# EAGLE design mainboard (EAGLE 7.7.0)
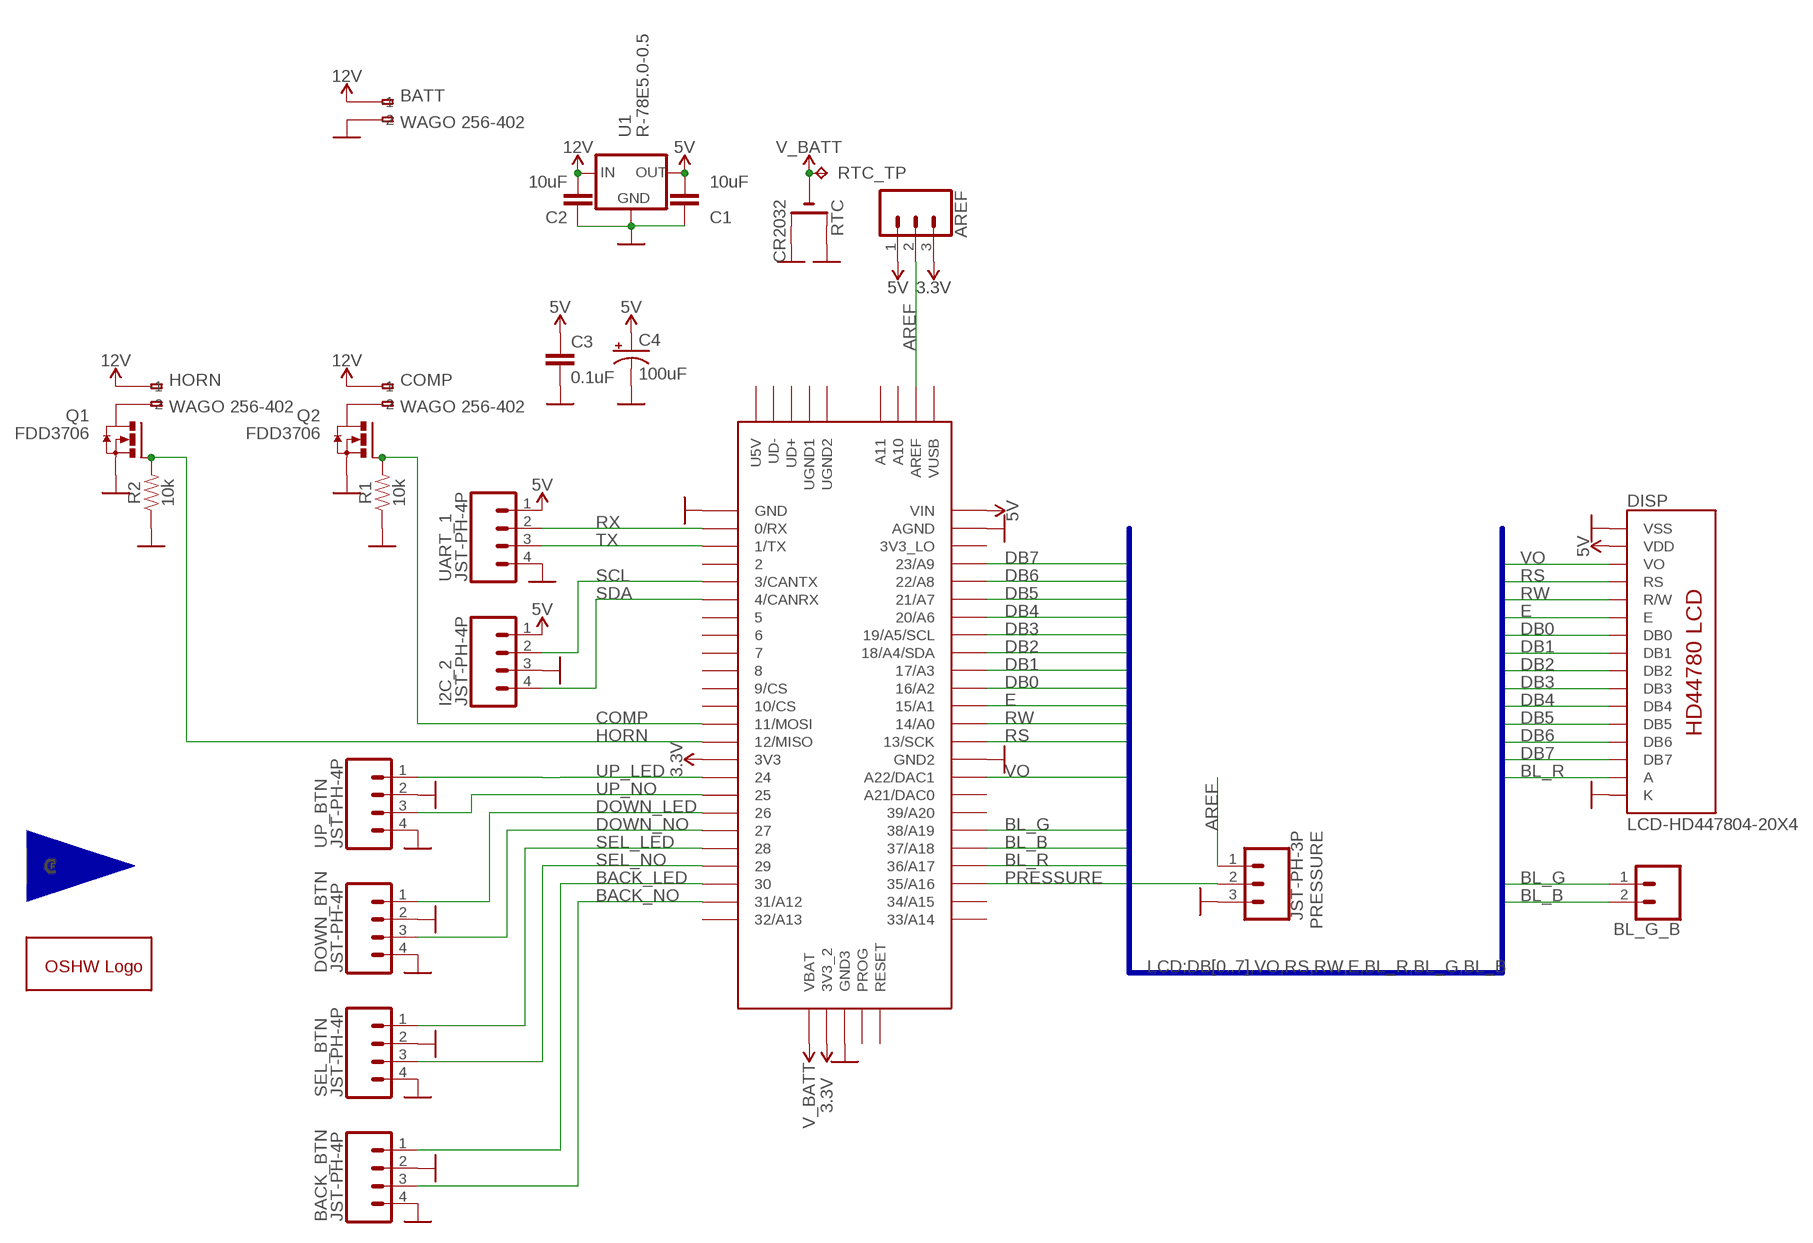
[diagram p0: schematic, sheet 1]

## Parts
AREF  CONN_03LOCK  [1X03_LOCK]
BACK_BTN  JST-PH-4P  CONN_04JST-PTH-VERT  [JST-4-PTH-VERT]
BATT  WAGO 256-402  255-402-5  [255-402-5]
BL_G_B  CONN_02  [1X02]
C1  10uF  10UF-0603-6.3V-20%  [0603]
C2  10uF  10UF-0603-6.3V-20%  [0603]
C3  0.1uF  0.1UF-0603-25V-(+80/-20%)  [0603]
C4  100uF  100UF-POLAR-10X10.5-63V-20%  [NIC_10X10.5_CAP]
COMP  WAGO 256-402  255-402-5  [255-402-5]
DISP  LCD-HD447804-20X4  LCD-HD447804-HOLES20X4-4HOLES  [LCD-20X4-4HOLES]
DOWN_BTN  JST-PH-4P  CONN_04JST-PTH-VERT  [JST-4-PTH-VERT]
GOLD_ORB_SM1  OSHWLOGOLOGO8MM  [OSHW_8MM]
HORN  WAGO 256-402  255-402-5  [255-402-5]
I2C_2  JST-PH-4P  CONN_04JST-PTH-VERT  [JST-4-PTH-VERT]
PRESSURE  JST-PH-3P  CONN_03JST-PTH-VERT  [JST-3-PTH-VERT]
Q1  FDD3706  IRF3704S  [D2PACK]
Q2  FDD3706  IRF3704S  [D2PACK]
R1  10k  10KOHM-0603-1/10W-1%  [0603]
R2  10k  10KOHM-0603-1/10W-1%  [0603]
RTC  CR2032  CR2032SMT  [CR2032-SMD]
RTC_TP  TPPAD1-17  [P1-17]
SEL_BTN  JST-PH-4P  CONN_04JST-PTH-VERT  [JST-4-PTH-VERT]
TEENSY  TEENSY_3.5/3.6  [TEENSY_3.5/3.6]
U1  R-78E5.0-0.5  R-78E5.0-1.0  [DC-DC_CONVERTER_78XX]
U$1  CFLOGO  [CFLOGO]
UART_1  JST-PH-4P  CONN_04JST-PTH-VERT  [JST-4-PTH-VERT]
UP_BTN  JST-PH-4P  CONN_04JST-PTH-VERT  [JST-4-PTH-VERT]

## Nets
3.3V: AREF.3 TEENSY.3V3 TEENSY.3V3_2
5V: AREF.1 C1.2 C3.1 C4.+ DISP.P$2(VDD) I2C_2.1 TEENSY.VIN U1.VOUT(OUT) UART_1.1
12V: BATT.A1(-1) C2.2 COMP.A1(-1) HORN.A1(-1) U1.VIN(IN)
AREF: AREF.2 PRESSURE.1 TEENSY.AREF
BACK_LED: BACK_BTN.1 TEENSY.30
BACK_NO: BACK_BTN.3 TEENSY.31/A12
BL_B: BL_G_B.2 TEENSY.37/A18
BL_G: BL_G_B.1 TEENSY.38/A19
BL_R: DISP.P$15(A) TEENSY.36/A17
COMP: Q2.1(G) R1.2 TEENSY.11/MOSI
DB0: DISP.P$7(DB0) TEENSY.16/A2
DB1: DISP.P$8(DB1) TEENSY.17/A3
DB2: DISP.P$9(DB2) TEENSY.18/A4/SDA
DB3: DISP.P$10(DB3) TEENSY.19/A5/SCL
DB4: DISP.P$11(DB4) TEENSY.20/A6
DB5: DISP.P$12(DB5) TEENSY.21/A7
DB6: DISP.P$13(DB6) TEENSY.22/A8
DB7: DISP.P$14(DB7) TEENSY.23/A9
DOWN_LED: DOWN_BTN.1 TEENSY.26
DOWN_NO: DOWN_BTN.3 TEENSY.27
E: DISP.P$6(E) TEENSY.15/A1
GND: BACK_BTN.2 BACK_BTN.4 BATT.A2(-2) C1.1 C2.1 C3.2 C4.- DISP.P$1(VSS) DISP.P$16(K) DOWN_BTN.2 DOWN_BTN.4 I2C_2.3 PRESSURE.3 Q1.3(S) Q2.3(S) R1.1 R2.1 RTC.+$1(+) RTC.+$2(+1) SEL_BTN.2 SEL_BTN.4 TEENSY.AGND TEENSY.GND TEENSY.GND2 TEENSY.GND3 U1.GND UART_1.4 UP_BTN.2 UP_BTN.4
HORN: Q1.1(G) R2.2 TEENSY.12/MISO
N$5: HORN.A2(-2) Q1.2(D)
N$6: COMP.A2(-2) Q2.2(D)
PRESSURE: PRESSURE.2 TEENSY.35/A16
RS: DISP.P$4(RS) TEENSY.13/SCK
RW: DISP.P$5(R/W) TEENSY.14/A0
RX: TEENSY.0/RX UART_1.2
SCL: I2C_2.2 TEENSY.3/CANTX
SDA: I2C_2.4 TEENSY.4/CANRX
SEL_LED: SEL_BTN.1 TEENSY.28
SEL_NO: SEL_BTN.3 TEENSY.29
TX: TEENSY.1/TX UART_1.3
UP_LED: TEENSY.24 UP_BTN.1
UP_NO: TEENSY.25 UP_BTN.3
V_BATT: RTC.- RTC_TP.TP TEENSY.VBAT
VO: DISP.P$3(VO) TEENSY.A22/DAC1
Unconnected: BATT.B1(B-1) BATT.B2(B-2) COMP.B1(B-1) COMP.B2(B-2) HORN.B1(B-1) HORN.B2(B-2) TEENSY.2 TEENSY.3V3_LO TEENSY.5 TEENSY.6 TEENSY.7 TEENSY.8 TEENSY.9/CS TEENSY.10/CS TEENSY.21/DAC0(A21/DAC0) TEENSY.32/A13 TEENSY.33/A14 TEENSY.34/A15 TEENSY.39/A20 TEENSY.A10 TEENSY.A11 TEENSY.PROG TEENSY.RESET TEENSY.U5V TEENSY.UD+ TEENSY.UD- TEENSY.UGND1 TEENSY.UGND2 TEENSY.VUSB

## Buses
LCD:DB[0..7],VO,RS,RW,E,BL_R,BL_G,BL_B

## Library data of the parts
AREF = SparkFun-Connectors:CONN_03: Multi connection point. Often used as Generic Header-pin footprint for 0.1 inch spaced/style header connections On any of the 0.1 inch spaced packages, you can populate with these: Break Away Headers - Straight <https://www.sparkfun.com/products/116> (PRT-00116) Break Away Male Headers - Right Angle <https://www.sparkfun.com/products/553> (PRT-00553) Female Headers <https://www.sparkfun.com/products/115> (PRT-00115) Break Away Headers - Machine Pin <https://www.sparkfun.com/products/117> (PRT-00117) Break Away Female Headers - Swiss Machine Pin <https://www.sparkfun.com/products/743> (PRT-00743) Stackable Header - 3 Pin (Female, 0.1") <https://www.sparkfun.com/products/13875> (PRT-13875) For SCREWTERMINALS and SPRING TERMINALS visit here: Screw Terimnals on SparkFun.com <https://www.sparkfun.com/search/results?term=Screw+Terminals> (5mm/3.5mm/2.54mm spacing) This device is also useful as a general connection point to wire up your design to another part of your project. Our various solder wires solder well into these plated through hole pads. Hook-Up Wire - Assortment (Stranded, 22 AWG) <https://www.sparkfun.com/products/11375> (PRT-11375) Hook-Up Wire - Assortment (Solid Core, 22 AWG) <https://www.sparkfun.com/products/11367> (PRT-11367) View the entire wire category on our website here <https://www.sparkfun.com/categories/141> Special notes: Molex polarized connector foot print use with SKU : PRT-08232 with associated crimp pins and housings.
BACK_BTN DOWN_BTN I2C_2 SEL_BTN UART_1 UP_BTN = SparkFun-Connectors:CONN_04: Multi connection point. Often used as Generic Header-pin footprint for 0.1 inch spaced/style header connections On any of the 0.1 inch spaced packages, you can populate with these: Break Away Headers - Straight <https://www.sparkfun.com/products/116> (PRT-00116) Break Away Male Headers - Right Angle <https://www.sparkfun.com/products/553> (PRT-00553) Female Headers <https://www.sparkfun.com/products/115> (PRT-00115) Break Away Headers - Machine Pin <https://www.sparkfun.com/products/117> (PRT-00117) Break Away Female Headers - Swiss Machine Pin <https://www.sparkfun.com/products/743> (PRT-00743) For SCREWTERMINALS and SPRING TERMINALS visit here: Screw Terimnals on SparkFun.com <https://www.sparkfun.com/search/results?term=Screw+Terminals> (5mm/3.5mm/2.54mm spacing) This device is also useful as a general connection point to wire up your design to another part of your project. Our various solder wires solder well into these plated through hole pads. Hook-Up Wire - Assortment (Stranded, 22 AWG) <https://www.sparkfun.com/products/11375> (PRT-11375) Hook-Up Wire - Assortment (Solid Core, 22 AWG) <https://www.sparkfun.com/products/11367> (PRT-11367) View the entire wire category on our website here <https://www.sparkfun.com/categories/141> Special notes: Molex polarized connector foot print use with SKU : PRT-08231 with associated crimp pins and housings. 1MM SMD Version SKU: PRT-10208; PROD_ID: CONN-13251
BATT COMP HORN = con-wago255:255-402-5: WAGO; OC_FARNELL: unknown; OC_NEWARK: unknown
BL_G_B = SparkFun-Connectors:CONN_02: Multi connection point. Often used as Generic Header-pin footprint for 0.1 inch spaced/style header connections On any of the 0.1 inch spaced packages, you can populate with these: Break Away Headers - Straight <https://www.sparkfun.com/products/116> (PRT-00116) Break Away Male Headers - Right Angle <https://www.sparkfun.com/products/553> (PRT-00553) Female Headers <https://www.sparkfun.com/products/115> (PRT-00115) Break Away Headers - Machine Pin <https://www.sparkfun.com/products/117> (PRT-00117) Break Away Female Headers - Swiss Machine Pin <https://www.sparkfun.com/products/743> (PRT-00743) For SCREWTERMINALS and SPRING TERMINALS visit here: Screw Terimnals on SparkFun.com <https://www.sparkfun.com/search/results?term=Screw+Terminals> (5mm/3.5mm/2.54mm spacing) This device is also useful as a general connection point to wire up your design to another part of your project. Our various solder wires solder well into these plated through hole pads. Hook-Up Wire - Assortment (Stranded, 22 AWG) <https://www.sparkfun.com/products/11375> (PRT-11375) Hook-Up Wire - Assortment (Solid Core, 22 AWG) <https://www.sparkfun.com/products/11367> (PRT-11367) View the entire wire category on our website here <https://www.sparkfun.com/categories/141> Special notes: Molex polarized connector foot print use with: PRT-08233 with associated crimp pins and housings. 2.54_SCREWTERM for use with PRT-10571. 3.5mm Screw Terminal footprints for PRT-08084 5mm Screw Terminal footprints for use with PRT-08432
C1 C2 = SparkFun-Capacitors:10UF: 10.0µF ceramic capacitors A capacitor is a passive two-terminal electrical component used to store electrical energy temporarily in an electric field.; PROD_ID: CAP-11015
C3 = SparkFun-Capacitors:0.1UF: 0.1µF ceramic capacitors A capacitor is a passive two-terminal electrical component used to store electrical energy temporarily in an electric field.; PROD_ID: CAP-00810
C4 = SparkFun-Capacitors:100UF-POLAR: 100µF polarized capacitors A capacitor is a passive two-terminal electrical component used to store electrical energy temporarily in an electric field.; PROD_ID: CAP-08362
DISP = HD44780LCD:LCD-HD44780
GOLD_ORB_SM1 = oshw:OSHWLOGO: The OSHW logo for PCB layout
PRESSURE = SparkFun-Connectors:CONN_03: Multi connection point. Often used as Generic Header-pin footprint for 0.1 inch spaced/style header connections On any of the 0.1 inch spaced packages, you can populate with these: Break Away Headers - Straight <https://www.sparkfun.com/products/116> (PRT-00116) Break Away Male Headers - Right Angle <https://www.sparkfun.com/products/553> (PRT-00553) Female Headers <https://www.sparkfun.com/products/115> (PRT-00115) Break Away Headers - Machine Pin <https://www.sparkfun.com/products/117> (PRT-00117) Break Away Female Headers - Swiss Machine Pin <https://www.sparkfun.com/products/743> (PRT-00743) Stackable Header - 3 Pin (Female, 0.1") <https://www.sparkfun.com/products/13875> (PRT-13875) For SCREWTERMINALS and SPRING TERMINALS visit here: Screw Terimnals on SparkFun.com <https://www.sparkfun.com/search/results?term=Screw+Terminals> (5mm/3.5mm/2.54mm spacing) This device is also useful as a general connection point to wire up your design to another part of your project. Our various solder wires solder well into these plated through hole pads. Hook-Up Wire - Assortment (Stranded, 22 AWG) <https://www.sparkfun.com/products/11375> (PRT-11375) Hook-Up Wire - Assortment (Solid Core, 22 AWG) <https://www.sparkfun.com/products/11367> (PRT-11367) View the entire wire category on our website here <https://www.sparkfun.com/categories/141> Special notes: Molex polarized connector foot print use with SKU : PRT-08232 with associated crimp pins and housings.; PROD_ID: CONN-13230
Q1 Q2 = transistor-power:IRF3704: SMPS MOSFET HEXFET® Power MOSFET Source: http://www.irf.com/product-info/datasheets/data/irf3704.pdf
R1 R2 = SparkFun-Resistors:10KOHM: 10kΩ resistor A resistor is a passive two-terminal electrical component that implements electrical resistance as a circuit element. Resistors act to reduce current flow, and, at the same time, act to lower voltage levels within circuits. - Wikipedia; PROD_ID: RES-00824
RTC = adafruit:CR2032
RTC_TP = testpad:TP: Test pad
TEENSY = Teensy356:TEENSY_3.5/3.6
U1 = SparkFun-IC-Power:R-78E5.0-1.0: Recom Power 5V 1A DC/DC Converter The Recom R-78E5.0-X.X is a compact DC/DC converter module that is a pin for pin drop-in replacement for the LM7805 linear voltage regulator. Specifications: Input Range: 7-28V Output Voltage: 5V Output Current: 1A Max Efficiency: 91% Datasheet <https://www.recom-power.com/pdf/Innoline/R-78Exx-1.0.pdf>; PROD_ID: COM-13655
U$1 = autobuoy:CFLOGO: CreekFleet logo

## Board
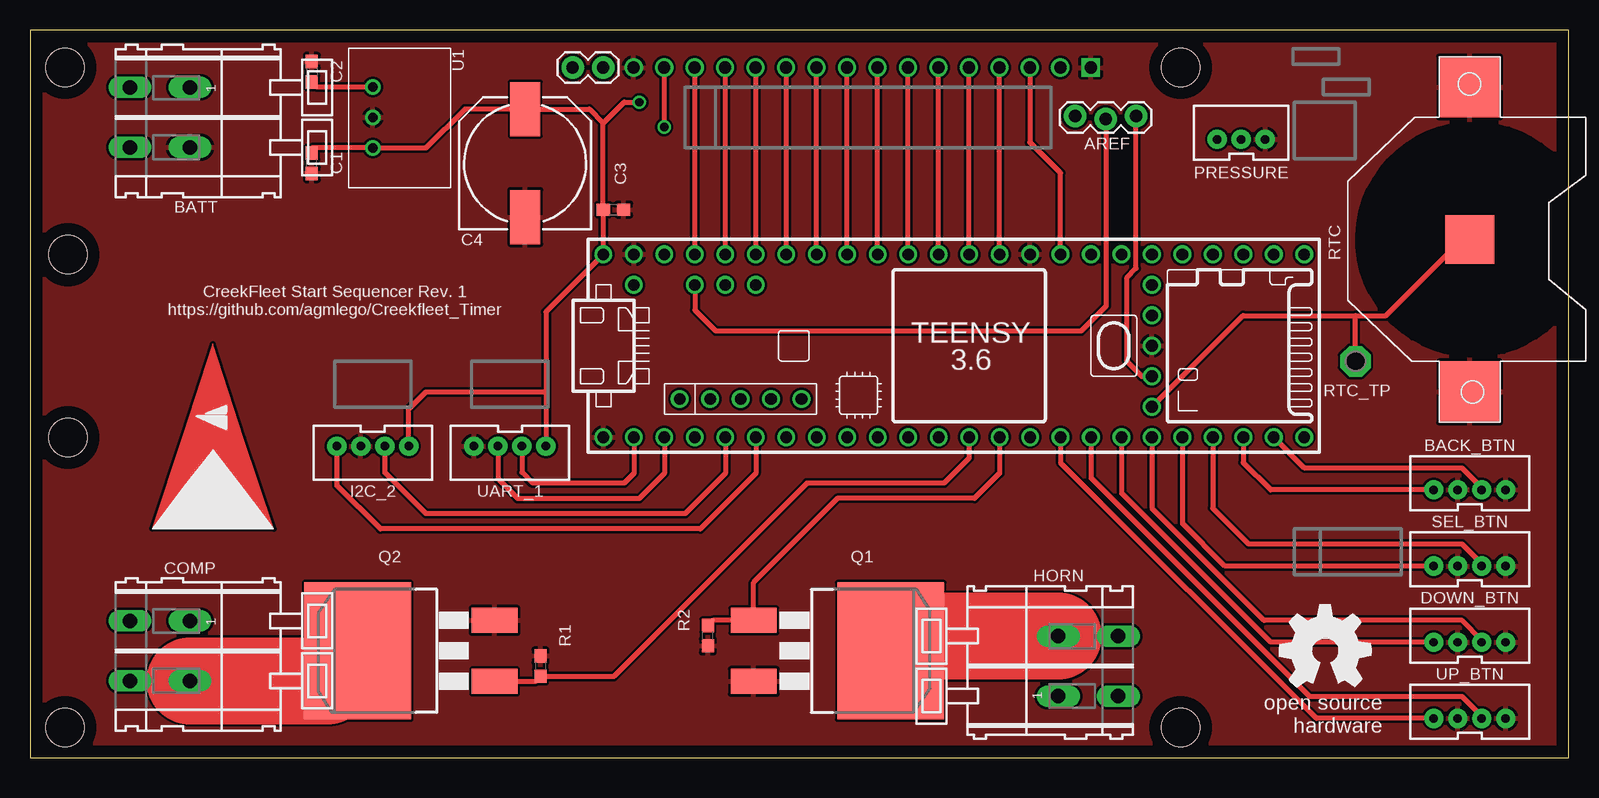
[diagram p1: board, top side]
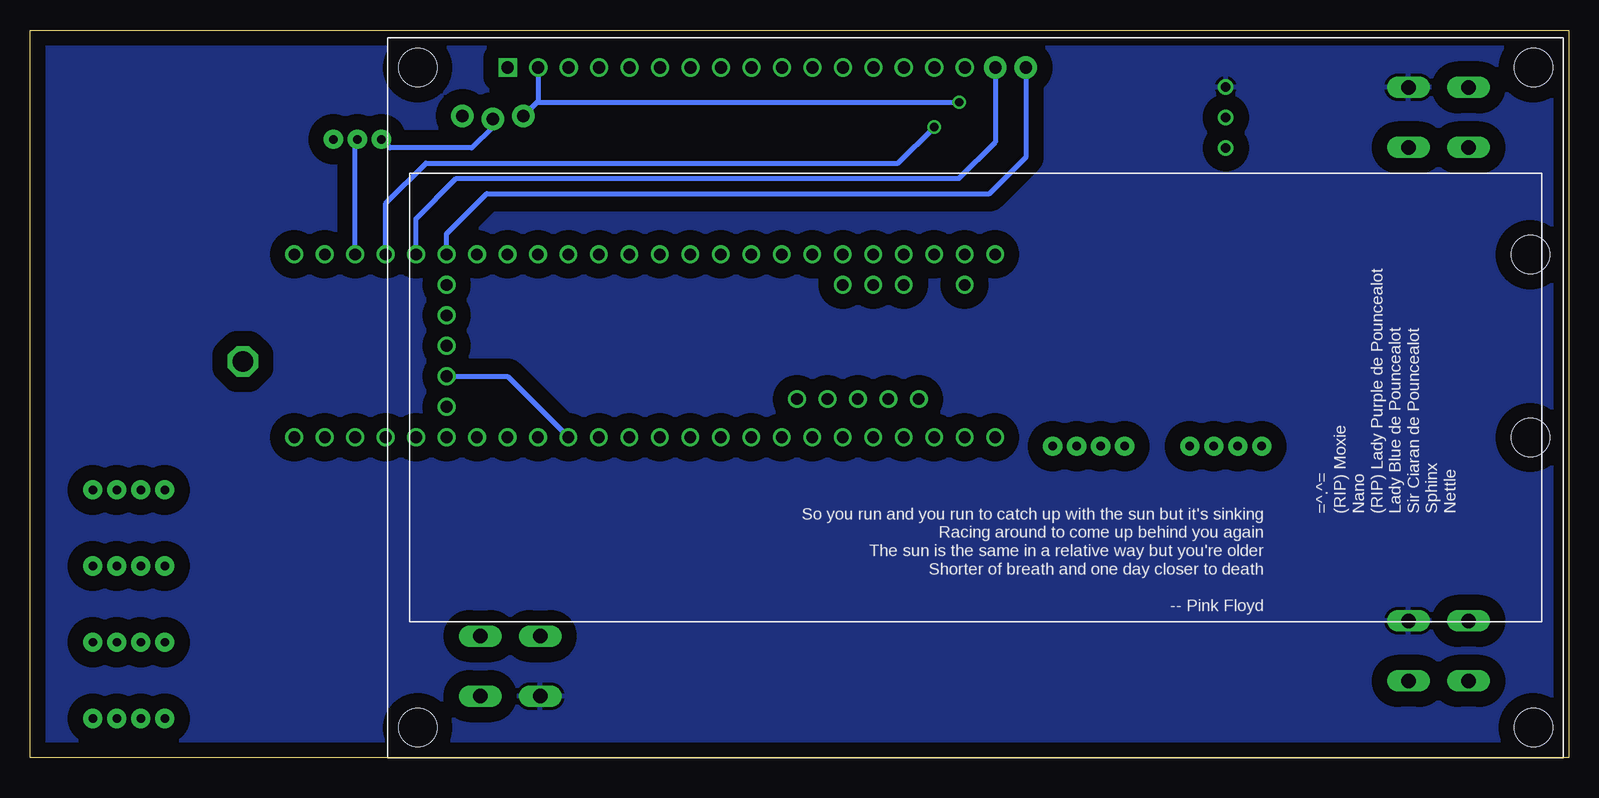
[diagram p2: board, bottom side, seen from below]

Size 128.25 x 60.63 mm. Coordinates in mm from the lower left corner, seen from the top.
Outline: 0,0 128.25,0 128.25,60.63 0,60.63 0,0
Copper layers (1*16): Top 0.035mm / dielectric 1.5mm / Bottom 0.035mm
Design rules "default": minimum track width 10mil, minimum drill 24mil, track to track 8mil, track to pad 8mil, pad to pad 8mil, via to via 8mil, smd to smd 8mil, copper to edge 40mil, drill to drill 8mil, minimum pad ring 10mil, minimum via ring 8mil, stop-mask expansion 4mil, vias tented up to drill 0mil, thermal gap 10mil
Holes 3.2 mm at 3.17,41.91 3.17,26.67
tRestrict: 3 lines

### Footprints (pad centres in the part's own frame; a part is rotated, then mirrored left to right if it is on the bottom)
1X03_LOCK = drill 1.016 pad 1.88: 1 0,0.127; 2 2.54,-0.127; 3 5.08,0.127
JST-4-PTH-VERT = drill 0.7 pad 1.6: 1 -3,-0.55; 2 -1,-0.55; 3 1,-0.55; 4 3,-0.55
255-402-5 = drill 1.2 long: A1 -2.5,0; A2 2.5,0; B1 -2.5,-5; B2 2.5,-5
1X02 = drill 1.016 pad 1.88: 1 0,0; 2 2.54,0
0603 = smd 1.1 x 1: 1 -0.85,0; 2 0.85,0
NIC_10X10.5_CAP = smd 4.5 x 2.5: + 4.5,0; - -4.5,0
LCD-20X4-4HOLES = drill 1.016 square: P$1 10,57.5 | drill 1.016: P$2 12.54,57.5; P$3 15.08,57.5; P$4 17.62,57.5; P$5 20.16,57.5; P$6 22.7,57.5; P$7 25.24,57.5; P$8 27.78,57.5; P$9 30.32,57.5; P$10 32.86,57.5; P$11 35.4,57.5; P$12 37.94,57.5; P$13 40.48,57.5; P$14 43.02,57.5; P$15 45.56,57.5; P$16 48.1,57.5 | hole 3.2: 2.5,2.5; 2.5,57.5; 95.5,57.5; 95.5,2.5
JST-3-PTH-VERT = drill 0.7 pad 1.6: 1 -2,-0.55; 2 0,-0.55; 3 2,-0.55
D2PACK = smd 2.083 x 3.81: 1 -2.54,-8.89; 3 2.54,-8.89 | smd 11.43 x 8.89: 2 0,2.54
CR2032-SMD = smd 5.08 x 5.08: +$1 -12.7,0; +$2 12.7,0 | smd 4.064 x 4.064: - 0,0
P1-17 = drill 1.702 pad 2.54 octagon: TP 0,0
TEENSY_3.5/3.6 = drill 0.965: 0/RX -25.4,-7.62; 1/TX -22.86,-7.62; 2 -20.32,-7.62; 3/CANTX -17.78,-7.62; 3V3 7.62,-7.62; 3V3_2 17.78,-2.54; 3V3_LO -22.86,7.62; 4/CANRX -15.24,-7.62; 5 -12.7,-7.62; 6 -10.16,-7.62; 7 -7.62,-7.62; 8 -5.08,-7.62; 9/CS -2.54,-7.62; 10/CS 0,-7.62; 11/MOSI 2.54,-7.62; 12/MISO 5.08,-7.62; 13/SCK 5.08,7.62; 14/A0 2.54,7.62; 15/A1 0,7.62; 16/A2 -2.54,7.62; 17/A3 -5.08,7.62; 18/A4/SDA -7.62,7.62; 19/A5/SCL -10.16,7.62; 20/A6 -12.7,7.62; 21/A7 -15.24,7.62; 21/DAC0 12.7,7.62; 22/A8 -17.78,7.62; 23/A9 -20.32,7.62; 24 10.16,-7.62; 25 12.7,-7.62; 26 15.24,-7.62; 27 17.78,-7.62; 28 20.32,-7.62; 29 22.86,-7.62; 30 25.4,-7.62; 31/A12 27.94,-7.62; 32/A13 30.48,-7.62; 33/A14 30.48,7.62; 34/A15 27.94,7.62; 35/A16 25.4,7.62; 36/A17 22.86,7.62; 37/A18 20.32,7.62; 38/A19 17.78,7.62; 39/A20 15.24,7.62; A10 -17.78,5.08; A11 -15.24,5.08; A22/DAC1 10.16,7.62; AGND -25.4,7.62; AREF -20.32,5.08; GND -27.94,-7.62; GND2 7.62,7.62; GND3 17.78,0; PROG 17.78,2.54; RESET 17.78,5.08; U5V -21.59,-4.445; UD+ -16.51,-4.445; UD- -19.05,-4.445; UGND1 -13.97,-4.445; UGND2 -11.43,-4.445; VBAT 17.78,-5.08; VIN -27.94,7.62; VUSB -25.4,5.08
DC-DC_CONVERTER_78XX = drill 0.8: GND 0,0; VIN -2.54,0; VOUT 2.54,0

### Placement (x,y rotation side)
AREF  87.12,53.34 0 top
BACK_BTN  120.02,22.86 0 top
BATT  13.34,53.34 270 top
BL_G_B  45.24,57.51 0 top
C1  23.5,49.53 90 top
C2  23.5,57.15 270 top
C3  48.64,45.67 0 top
C4  41.27,49.53 90 top
COMP  13.34,8.89 270 top
DISP  98.42,0 0 bottom
DOWN_BTN  120.02,10.16 0 top
GOLD_ORB_SM1  107.95,8.89 0 top
HORN  85.72,7.62 90 top
I2C_2  28.57,25.4 180 top
PRESSURE  100.97,52.07 0 top
Q1  69.22,8.89 270 top
Q2  29.84,8.89 90 top
R1  42.55,7.62 270 top
R2  56.52,10.16 90 top
RTC  120.02,43.18 270 top
RTC_TP  110.49,33.02 0 top
SEL_BTN  120.02,16.51 0 top
TEENSY  75.74,34.32 0 top
U1  28.57,53.34 270 top
U$1  20.32,19.05 90 top
UART_1  40.01,25.4 180 top
UP_BTN  120.02,3.81 0 top

### Tracks (layer width: path | path; a pad name or v marks a point on that pad's centre or on a via)
3.3V
  Top 0.406: TEENSY.3V3_2 92.69,31.77 91.44,33.02 91.44,40.01 92.2,40.77 AREF.3
  Bottom 0.406: TEENSY.3V3_2 88.44,31.77 TEENSY.3V3
5V  (via drill 0.7)
  Top 0.406: C1.2 23.5,50.8 U1.VOUT 33.02,50.8 36.25,54.03 C4.+ 46.63,54.03 47.79,52.87 | 47.79,52.87 C3.1 47.8,45.66 TEENSY.VIN 43.01,37.14 43.01,30.48 | 47.79,52.87 49.53,54.61 v50.8,54.61 | 43.01,30.48 UART_1.1 | I2C_2.1 31.57,29.04 33.02,30.48 43.01,30.48
  Bottom 0.406: 85.98,54.61 v50.8,54.61 | 85.98,54.61 AREF.1 | DISP.P$2 85.89,54.7 85.98,54.61
12V
  Top 0.406: U1.VIN 23.91,55.88 C2.2
  pour Bottom (isolate 1.27): 0,60.96 128.27,60.96 128.27,0 0,0
AREF
  Top 0.406: TEENSY.AREF 55.42,37.29 57.15,35.56 87.63,35.56 89.71,37.64 89.71,53.16 AREF.2
  Bottom 0.406: PRESSURE.1 98.25,50.8 91.44,50.8 89.66,52.58 AREF.2
BACK_LED
  Top 0.406: BACK_BTN.1 103.42,22.31 101.14,24.59 TEENSY.30
BACK_NO
  Top 0.406: BACK_BTN.3 121.02,22.5 119.38,24.13 106.25,24.13 TEENSY.31/A12
BL_B
  Bottom 0.406: TEENSY.37/A18 96.06,44.91 92.71,48.26 50.8,48.26 47.78,51.28 BL_G_B.2
BL_G
  Bottom 0.406: TEENSY.38/A19 93.52,43.64 90.17,46.99 48.26,46.99 46.35,48.9 45.72,49.53 45.24,50.01 BL_G_B.1
BL_R  (via drill 0.7)
  Top 0.406: DISP.P$15 v52.87,52.55
  Bottom 0.406: TEENSY.36/A17 98.6,46.18 95.25,49.53 55.88,49.53 v52.87,52.55
COMP
  Top 0.406: Q2.1 42.12,6.35 R1.2 48.68,6.77 64.77,22.86 76.2,22.86 78.28,24.94 TEENSY.11/MOSI
DB0
  Top 0.406: TEENSY.16/A2 73.2,57.48 DISP.P$7
DB1
  Top 0.406: TEENSY.17/A3 70.66,57.48 DISP.P$8
DB2
  Top 0.406: TEENSY.18/A4/SDA 68.12,57.48 DISP.P$9
DB3
  Top 0.406: TEENSY.19/A5/SCL 65.58,57.48 DISP.P$10
DB4
  Top 0.406: TEENSY.20/A6 63.04,57.48 DISP.P$11
DB5
  Top 0.406: TEENSY.21/A7 60.5,57.48 DISP.P$12
DB6
  Top 0.406: TEENSY.22/A8 57.96,57.48 DISP.P$13
DB7
  Top 0.406: TEENSY.23/A9 55.42,57.48 DISP.P$14
DOWN_LED
  Top 0.406: DOWN_BTN.1 103.42,9.61 90.98,22.05 TEENSY.26
DOWN_NO
  Top 0.406: DOWN_BTN.3 121.02,9.79 119.38,11.43 102.87,11.43 93.52,20.78 TEENSY.27
E
  Top 0.406: TEENSY.15/A1 75.74,57.48 DISP.P$6
GND
  pour Top: 0,60.96 128.27,60.96 128.27,0 0,0
HORN
  Top 0.406: R2.2 56.94,11.43 Q1.1 60.33,14.61 67.31,21.59 78.74,21.59 80.82,23.67 TEENSY.12/MISO
N$5
  Top 7.239: HORN.A2 72.98,10.12 Q1.2
N$6
  Top 7.239: COMP.A2 24.8,6.39 Q2.2
PRESSURE
  Bottom 0.406: TEENSY.35/A16 101.14,51.34 PRESSURE.2
RS
  Top 0.406: TEENSY.13/SCK 80.82,57.48 DISP.P$4
RW
  Top 0.406: TEENSY.14/A0 78.28,57.48 DISP.P$5
RX
  Top 0.406: TEENSY.0/RX 50.34,23.67 49.53,22.86 41.91,22.86 41.01,23.77 UART_1.2
SCL
  Top 0.406: TEENSY.3/CANTX 57.96,23.67 54.61,20.32 33.02,20.32 29.57,23.77 I2C_2.2
SDA
  Top 0.406: TEENSY.4/CANRX 60.5,23.67 55.88,19.05 29.21,19.05 25.57,22.68 I2C_2.4
SEL_LED
  Top 0.406: SEL_BTN.1 99.61,15.96 96.06,19.51 TEENSY.28
SEL_NO
  Top 0.406: SEL_BTN.3 121.02,16.14 119.38,17.78 101.6,17.78 98.6,20.78 TEENSY.29
TX
  Top 0.406: UART_1.3 39.01,23.23 40.64,21.59 50.8,21.59 52.88,23.67 TEENSY.1/TX
UP_LED
  Top 0.406: UP_BTN.1 107.23,3.26 85.9,24.59 TEENSY.24
UP_NO
  Top 0.406: UP_BTN.3 121.02,3.44 119.38,5.08 106.68,5.08 88.44,23.32 TEENSY.25
V_BATT
  Top 0.406: TEENSY.VBAT 101.12,36.83 110.49,36.83 | 110.49,36.83 113.03,36.83 119.38,43.18 RTC.- | RTC_TP.TP 110.49,36.83
VO
  Top 0.406: TEENSY.A22/DAC1 85.9,48.72 83.34,51.27 DISP.P$3

### Text on the board
tDocu: DISP | 5V | AREF | 3V3 | 12V | - + | DISP | BL_G / BL_B / GND / BL_R / DB7 / DB6 / DB5 / DB4 / DB3 / DB2 / DB1 / DB0 / E / RW / RS / VO / 5V / GND | AREF / SIG / GND | DB7 | DB6 | DB5 | DB4 | DB3 | DB2 | DB1 | DB0 | E | RW | RS | VO | BL_G | BL_B | BL_R | PSIG | <- USB Tie -> | SDA / GND / SCL / 5V | GND / TX / RX / 5V | RX1 | TX1 | SCL2 | SDA2 | COMP | HORN | UP_LED | #UP_SW | DOWN_LED | #DOWN_SW | SEL_LED | #SEL_SW | BACK_LED | #BACK_SW | BTN | LED / GND / #SW / GND | - + | + -
_tsilk: CreekFleet Start Sequencer Rev. 1 / https://github.com/agmlego/Creekfleet_Timer
_bsilk: =^.^= / (RIP) Moxie / Nano / (RIP) Lady Purple de Pouncealot / Lady Blue de Pouncealot / Sir Ciaran de Pouncealot / Sphinx / Nettle | So you run and you run to catch up with the sun but it's sinking / Racing around to come up behind you again / The sun is the same in a relative way but you're older / Shorter of breath and one day closer to death / / -- Pink Floyd